# Altium schematic sheet Power.SchDoc: Laser PCB
size A3; DrawnBy: James Singleton; Organization: TMC Technology Ltd.; DocumentNumber: 8; Revision: A; SheetNumber: 8; SheetTotal: 18; Drawn Date: 22/12/2020
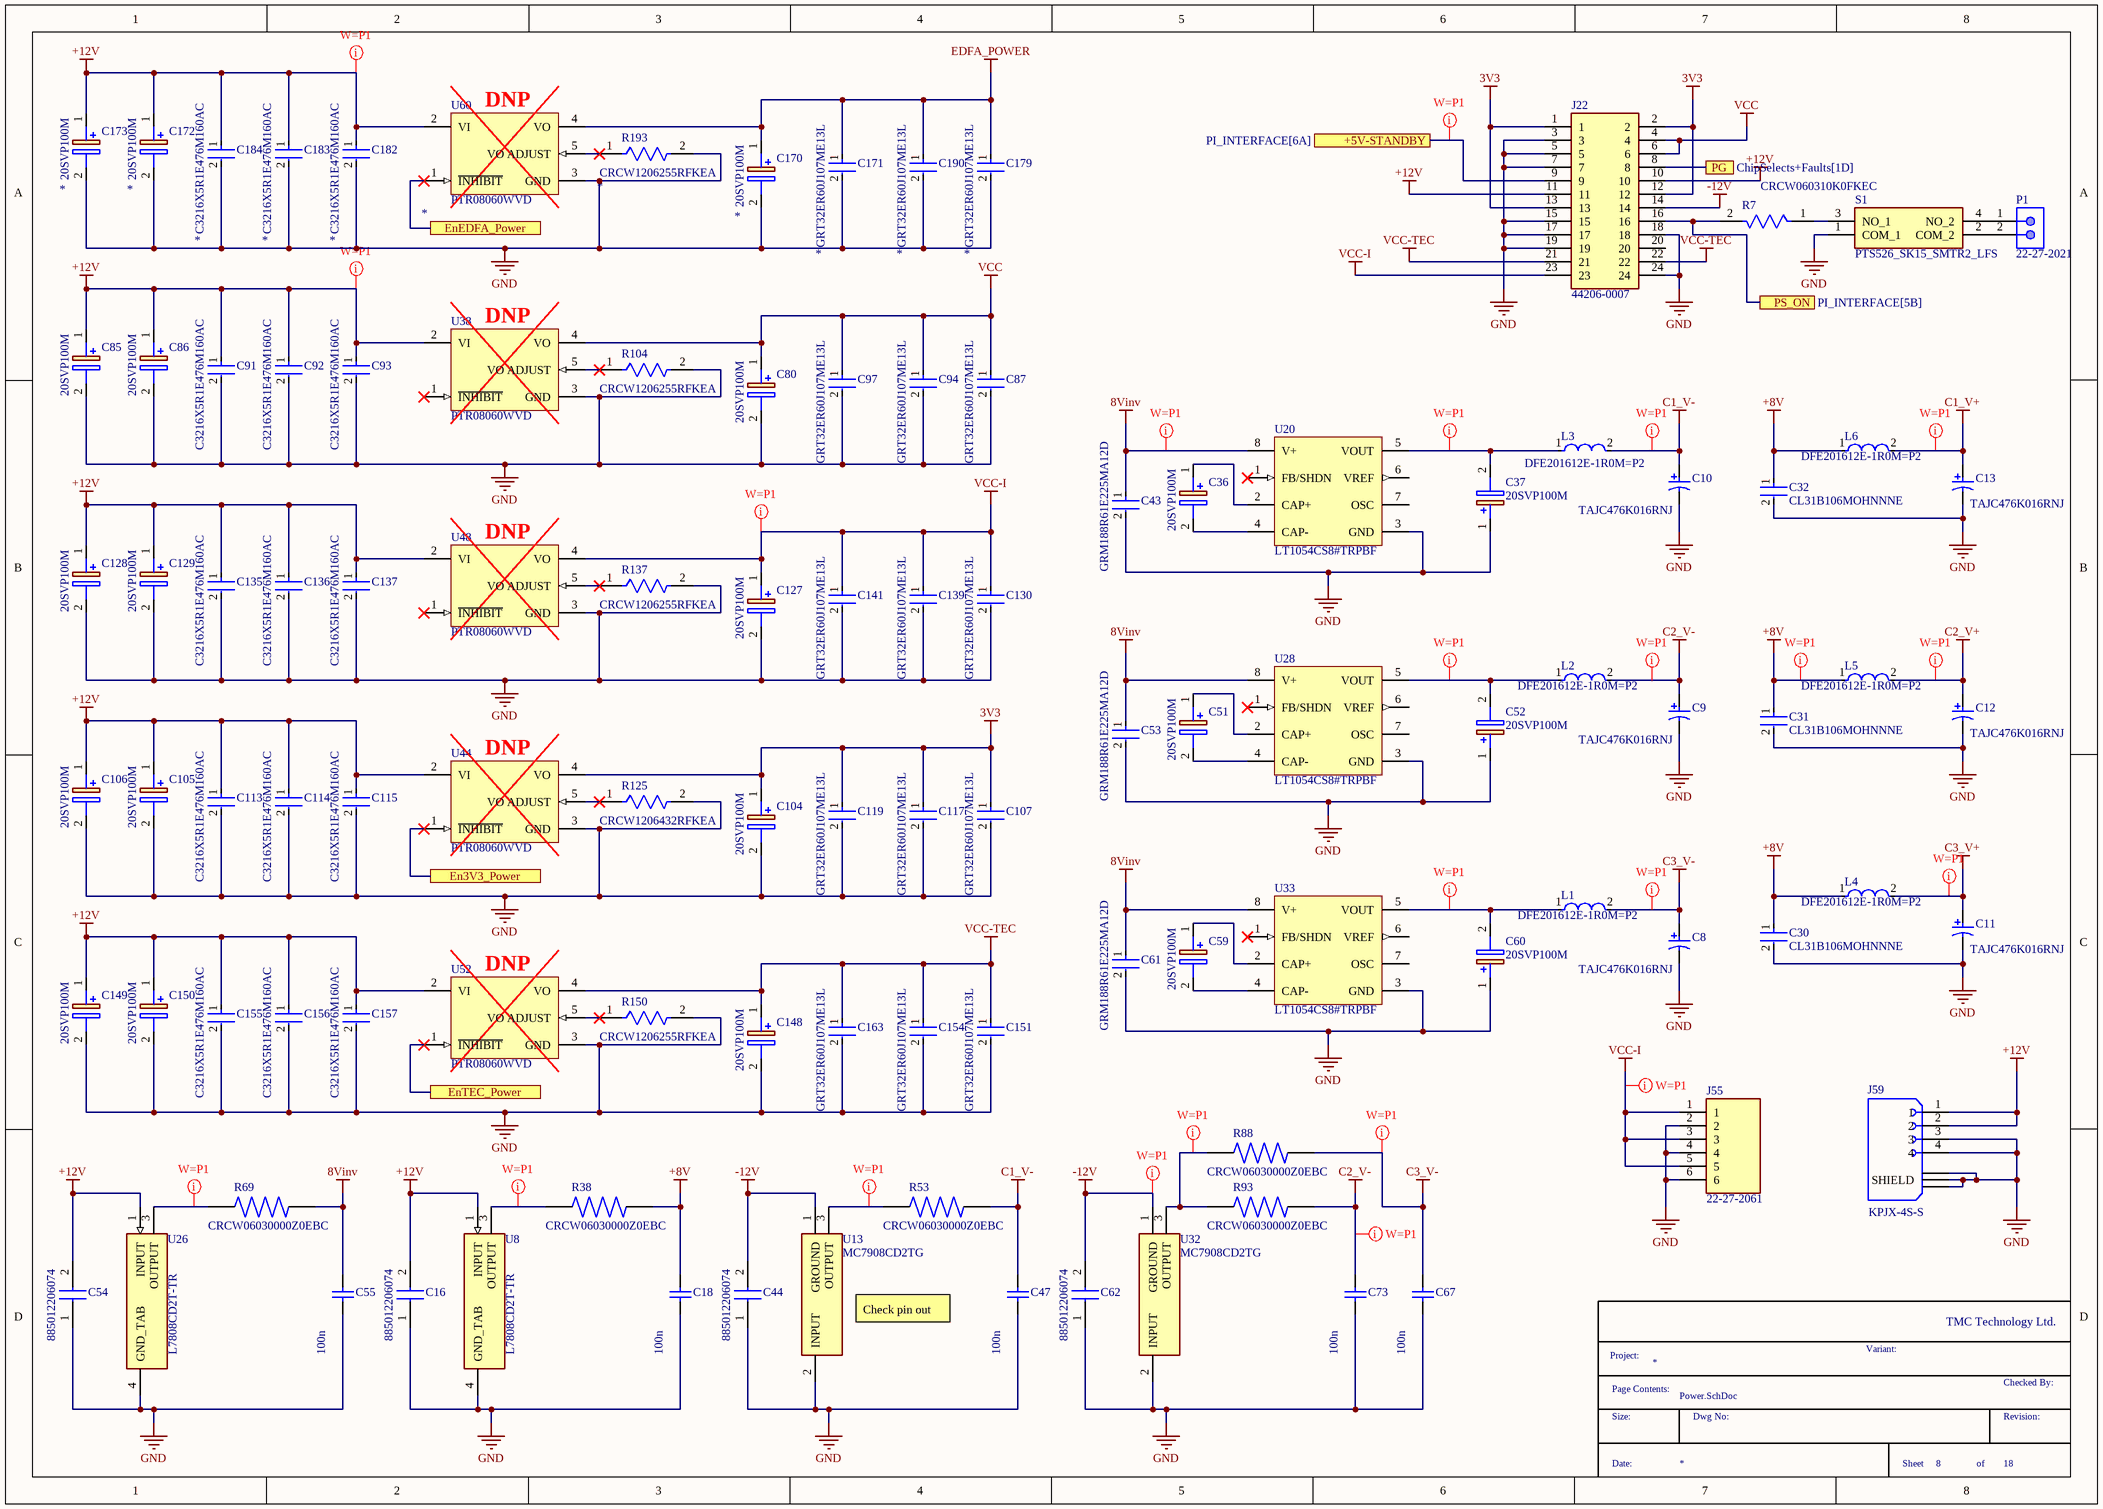
[diagram p0: Power.SchDoc]

## Parts
C8  TAJC476K016RNJ  [AVX-TAJ-C-2_M]
C9  TAJC476K016RNJ  [AVX-TAJ-C-2_M]
C10  TAJC476K016RNJ  [AVX-TAJ-C-2_M]
C11  TAJC476K016RNJ  [AVX-TAJ-C-2_M]
C12  TAJC476K016RNJ  [AVX-TAJ-C-2_M]
C13  TAJC476K016RNJ  [AVX-TAJ-C-2_M]
C16  885012206074  [CAPC1608X87N]
C18  100n  [CAPC1608X90X35LL15T15]
C30  CL31B106MOHNNNE  [FP-CL31-IPC_C]
C31  CL31B106MOHNNNE  [FP-CL31-IPC_C]
C32  CL31B106MOHNNNE  [FP-CL31-IPC_C]
C36  20SVP100M  [CAPAE830X1200N]
C37  20SVP100M  [CAPAE830X1200N]
C43  GRM188R61E225MA12D  [FP-GRM188-0_1-e0_2_0_5-IPC_A]
C44  885012206074  [CAPC1608X87N]
C47  100n  [CAPC1608X90X35LL15T15]
C51  20SVP100M  [CAPAE830X1200N]
C52  20SVP100M  [CAPAE830X1200N]
C53  GRM188R61E225MA12D  [FP-GRM188-0_1-e0_2_0_5-IPC_A]
C54  885012206074  [CAPC1608X87N]
C55  100n  [CAPC1608X90X35LL15T15]
C59  20SVP100M  [CAPAE830X1200N]
C60  20SVP100M  [CAPAE830X1200N]
C61  GRM188R61E225MA12D  [FP-GRM188-0_1-e0_2_0_5-IPC_A]
C62  885012206074  [CAPC1608X87N]
C67  100n  [CAPC1608X90X35LL15T15]
C73  100n  [CAPC1608X90X35LL15T15]
C80  20SVP100M  [CAPAE830X1200N]
C85  20SVP100M  [CAPAE830X1200N]
C86  20SVP100M  [CAPAE830X1200N]
C87  GRT32ER60J107ME13L  [FP-GRT32E-0_3-IPC_A]
C91  C3216X5R1E476M160AC  [FP-C3216-160-MFG]
C92  C3216X5R1E476M160AC  [FP-C3216-160-MFG]
C93  C3216X5R1E476M160AC  [FP-C3216-160-MFG]
C94  GRT32ER60J107ME13L  [FP-GRT32E-0_3-IPC_A]
C97  GRT32ER60J107ME13L  [FP-GRT32E-0_3-IPC_A]
C104  20SVP100M  [CAPAE830X1200N]
C105  20SVP100M  [CAPAE830X1200N]
C106  20SVP100M  [CAPAE830X1200N]
C107  GRT32ER60J107ME13L  [FP-GRT32E-0_3-IPC_A]
C113  C3216X5R1E476M160AC  [FP-C3216-160-MFG]
C114  C3216X5R1E476M160AC  [FP-C3216-160-MFG]
C115  C3216X5R1E476M160AC  [FP-C3216-160-MFG]
C117  GRT32ER60J107ME13L  [FP-GRT32E-0_3-IPC_A]
C119  GRT32ER60J107ME13L  [FP-GRT32E-0_3-IPC_A]
C127  20SVP100M  [CAPAE830X1200N]
C128  20SVP100M  [CAPAE830X1200N]
C129  20SVP100M  [CAPAE830X1200N]
C130  GRT32ER60J107ME13L  [FP-GRT32E-0_3-IPC_A]
C135  C3216X5R1E476M160AC  [FP-C3216-160-MFG]
C136  C3216X5R1E476M160AC  [FP-C3216-160-MFG]
C137  C3216X5R1E476M160AC  [FP-C3216-160-MFG]
C139  GRT32ER60J107ME13L  [FP-GRT32E-0_3-IPC_A]
C141  GRT32ER60J107ME13L  [FP-GRT32E-0_3-IPC_A]
C148  20SVP100M  [CAPAE830X1200N]
C149  20SVP100M  [CAPAE830X1200N]
C150  20SVP100M  [CAPAE830X1200N]
C151  GRT32ER60J107ME13L  [FP-GRT32E-0_3-IPC_A]
C154  GRT32ER60J107ME13L  [FP-GRT32E-0_3-IPC_A]
C155  C3216X5R1E476M160AC  [FP-C3216-160-MFG]
C156  C3216X5R1E476M160AC  [FP-C3216-160-MFG]
C157  C3216X5R1E476M160AC  [FP-C3216-160-MFG]
C163  GRT32ER60J107ME13L  [FP-GRT32E-0_3-IPC_A]
C170  20SVP100M  [CAPAE830X1200N]
C171  GRT32ER60J107ME13L  [FP-GRT32E-0_3-IPC_A]
C172  20SVP100M  [CAPAE830X1200N]
C173  20SVP100M  [CAPAE830X1200N]
C179  GRT32ER60J107ME13L  [FP-GRT32E-0_3-IPC_A]
C182  C3216X5R1E476M160AC  [FP-C3216-160-MFG]
C183  C3216X5R1E476M160AC  [FP-C3216-160-MFG]
C184  C3216X5R1E476M160AC  [FP-C3216-160-MFG]
C190  GRT32ER60J107ME13L  [FP-GRT32E-0_3-IPC_A]
J22  44206-0007  [442060007]
J55  22-27-2061  [HDRV6W64P0X254_1X6_1524X580X1170P]
J59  KPJX-4S-S  [KYCON_KPJX-4S-S]
L1  DFE201612E-1R0M=P2  [FP-DFE201612C-IPC_A]
L2  DFE201612E-1R0M=P2  [FP-DFE201612C-IPC_A]
L3  DFE201612E-1R0M=P2  [FP-DFE201612C-IPC_A]
L4  DFE201612E-1R0M=P2  [FP-DFE201612C-IPC_A]
L5  DFE201612E-1R0M=P2  [FP-DFE201612C-IPC_A]
L6  DFE201612E-1R0M=P2  [FP-DFE201612C-IPC_A]
P1  22-27-2021  [MOLX-22-27-2021_V]
R7  CRCW060310K0FKEC  [FP-CRCW0603-e3-IPC_A]
R38  CRCW06030000Z0EBC  [RESC1608X55N]
R53  CRCW06030000Z0EBC  [RESC1608X55N]
R69  CRCW06030000Z0EBC  [RESC1608X55N]
R88  CRCW06030000Z0EBC  [RESC1608X55N]
R93  CRCW06030000Z0EBC  [RESC1608X55N]
R104  CRCW1206255RFKEA  [FP-CRCW1206-e3-IPC_C]
R125  CRCW1206432RFKEA  [FP-CRCW1206-e3-IPC_B]
R137  CRCW1206255RFKEA  [FP-CRCW1206-e3-IPC_C]
R150  CRCW1206255RFKEA  [FP-CRCW1206-e3-IPC_B]
R193  CRCW1206255RFKEA  [FP-CRCW1206-e3-IPC_C]
S1  PTS526_SK15_SMTR2_LFS  [PTS526SK15SMTR2LFS]
U8  L7808CD2T-TR  [TO254P1542X460-3N]
U13  MC7908CD2TG  [MC7908CD2TR4G]
U20  LT1054CS8#TRPBF  [LT-S8-8_M]
U26  L7808CD2T-TR  [TO254P1542X460-3N]
U28  LT1054CS8#TRPBF  [LT-S8-8_M]
U32  MC7908CD2TG  [MC7908CD2TR4G]
U33  LT1054CS8#TRPBF  [LT-S8-8_M]
U38  PTR08060WVD  [EDP0005A]
U44  PTR08060WVD  [EDP0005A]
U48  PTR08060WVD  [EDP0005A]
U52  PTR08060WVD  [EDP0005A]
U60  PTR08060WVD  [EDP0005A]

## Ports
+5V-STANDBY (see PI_INTERFACE[6A]), En3V3_Power, EnEDFA_Power, EnTEC_Power, PG (see ChipSelects+Faults[1D]), PS_ON (see PI_INTERFACE[5B])

## Nets
3V3: C104.1(+) C107.1 C117.1 C119.1 J22.1 J22.2 J22.12 J22.13 U44.4(VO)
8Vinv: C43.1 C53.1 C55.2 C61.1 R69.2 U20.8(V+) U28.8(V+) U33.8(V+)
+8V: C18.2 C30.1 C31.1 C32.1 L4.1 L5.1 L6.1 R38.2
+12V: C16.2 C54.2 C85.1(+) C86.1(+) C91.1 C92.1 C93.1 C105.1(+) C106.1(+) C113.1 C114.1 C115.1 C128.1(+) C129.1(+) C135.1 C136.1 C137.1 C149.1(+) C150.1(+) C155.1 C156.1 C157.1 C172.1(+) C173.1(+) C182.1 C183.1 C184.1 J22.10 J22.11 J59.1 J59.2 U8.1(INPUT) U26.1(INPUT) U38.2(VI) U44.2(VI) U48.2(VI) U52.2(VI) U60.2(VI)
-12V: C44.2 C62.2 J22.14 U13.1(GROUND) U32.1(GROUND)
C1_V+: C13.1 L6.2
C1_V-: C10.1 C47.2 L3.2 R53.2
C2_V+: C12.1 L5.2
C2_V-: C9.1 C73.2 L2.2 R93.2
C3_V+: C11.1 L4.2
C3_V-: C8.1 C67.2 L1.2 R88.2
EDFA_POWER: C170.1(+) C171.1 C179.1 C190.1 U60.4(VO)
GND: C8.2 C9.2 C10.2 C11.2 C12.2 C13.2 C16.1 C18.1 C30.2 C31.2 C32.2 C37.1(+) C43.2 C44.1 C47.1 C52.1(+) C53.2 C54.1 C55.1 C60.1(+) C61.2 C62.1 C67.1 C73.1 C80.2(-) C85.2(-) C86.2(-) C87.2 C91.2 C92.2 C93.2 C94.2 C97.2 C104.2(-) C105.2(-) C106.2(-) C107.2 C113.2 C114.2 C115.2 C117.2 C119.2 C127.2(-) C128.2(-) C129.2(-) C130.2 C135.2 C136.2 C137.2 C139.2 C141.2 C148.2(-) C149.2(-) C150.2(-) C151.2 C154.2 C155.2 C156.2 C157.2 C163.2 C170.2(-) C171.2 C172.2(-) C173.2(-) C179.2 C182.2 C183.2 C184.2 C190.2 J22.3 J22.5 J22.7 J22.15 J22.17 J22.18 J22.19 J22.24 J55.2 J55.4 J55.6 J59.3 J59.4 J59.S1(SHIELD) J59.S2(SHIELD) J59.S3(SHIELD) R104.2 R125.2 R137.2 R150.2 R193.2 S1.1(COM_1) U8.4(GND_TAB) U13.2(INPUT) U20.3(GND) U26.4(GND_TAB) U28.3(GND) U32.2(INPUT) U33.3(GND) U38.3(GND) U44.3(GND) U48.3(GND) U52.3(GND) U60.3(GND)
VCC: C80.1(+) C87.1 C94.1 C97.1 J22.4 J22.6 U38.4(VO)
VCC-I: C127.1(+) C130.1 C139.1 C141.1 J22.23 J55.1 J55.3 J55.5 U48.4(VO)
VCC-TEC: C148.1(+) C151.1 C154.1 C163.1 J22.21 J22.22 U52.4(VO)
+5V-STANDBY: J22.9 ; port +5V-STANDBY
En3V3_Power: U44.1(~{INHIBIT}) ; port En3V3_Power
EnEDFA_Power: U60.1(~{INHIBIT}) ; port EnEDFA_Power
EnTEC_Power: U52.1(~{INHIBIT}) ; port EnTEC_Power
PG: J22.8 ; port PG
PS_ON: J22.16 R7.2 ; port PS_ON
NetC36_1: C36.1(+) U20.2(CAP+)
NetC36_2: C36.2(-) U20.4(CAP-)
NetC37_2: C37.2(-) L3.1 U20.5(VOUT)
NetC51_1: C51.1(+) U28.2(CAP+)
NetC51_2: C51.2(-) U28.4(CAP-)
NetC52_2: C52.2(-) L2.1 U28.5(VOUT)
NetC59_1: C59.1(+) U33.2(CAP+)
NetC59_2: C59.2(-) U33.4(CAP-)
NetC60_2: C60.2(-) L1.1 U33.5(VOUT)
NetP1_1: P1.1 S1.4(NO_2)
NetP1_2: P1.2 S1.2(COM_2)
NetR7_1: R7.1 S1.3(NO_1)
NetR38_1: R38.1 U8.3(OUTPUT)
NetR53_1: R53.1 U13.3(OUTPUT)
NetR69_1: R69.1 U26.3(OUTPUT)
NetR88_1: R88.1 R93.1 U32.3(OUTPUT)
NetR104_1: R104.1 U38.5(VO_ADJUST)
NetR125_1: R125.1 U44.5(VO_ADJUST)
NetR137_1: R137.1 U48.5(VO_ADJUST)
NetR150_1: R150.1 U52.5(VO_ADJUST)
NetR193_1: R193.1 U60.5(VO_ADJUST)

Not connected (* = marked no-connect by the designer): J22 20; U20 1(FB/SHDN)* 6(VREF) 7(OSC); U28 1(FB/SHDN)* 6(VREF) 7(OSC); U33 1(FB/SHDN)* 6(VREF) 7(OSC); U38 1(~{INHIBIT})*; U48 1(~{INHIBIT})*

## Layout directives
mark named W=P1: 8Vinv, +8V, +12V, -12V, C1_V+, C1_V-, C2_V+, C2_V-, C3_V+, C3_V-, NetC37_2, NetC52_2, NetC60_2, NetR38_1, NetR53_1, NetR69_1, NetR88_1, VCC-I
net class PowerOne: +5V-STANDBY

## Notes on the sheet
- (near U60) DNP
- (near U38) DNP
- (near U48) DNP
- (near U44) DNP
- (near U52) DNP
- (near U13) Check pin out
- TMC Technology Ltd.
- Page Contents:
- Project:
- Variant:
- Checked By:
- Size:
- Date:
- Dwg No:
- Sheet
- of
- Revision:

## Library data of the parts
C8-C13 = CMP-2100-03692-1: Standard Tantalum, 47 uF, +/- 10%, 16 V, -55 to 125 degC, 2-Pin SMD (2312), RoHS, Tape and Reel; Manufacturer: Kyocera AVX; Voltage Rating: 16V; Capacitance: 47uF; Leakage Current: 7.5uA; Dissipation Factor: 6%; ESR (Equivalent Series Resistance): 500mOhm; Resistance: 0.5Ohm; Polarity: Polar; RoHSCompliant: True; Datasheet URL: http://datasheets.avx.com/TAJ.pdf; Number of Pins: 2; Height - Seated (Max): 0.11inch; Package Description: 2-Pin Surface Mount Device, Body 6 x 3.25 mm; REACH SVHC: NoSVHC; Width: 3.2mm; Case/Package: Molded; Radiation Hardening: No; Max Operating Temperature: 125degC; Package Reference: TAJ-C-2; Package Quantity: 1; Manufacturer URL: http://www.avx.com/; Packaging: TapeandReel; Height: 2.6mm; Dielectric Material: Tantalum; Voltage Rating (DC): 16V; Datasheet Version: 42401.0; Voltage: 16V; Length: 6mm; Depth: 3.2mm; Termination: SMD/SMT; Tolerance: 10%; Case Code (Imperial): 2312; Min Operating Temperature: -55degC; Case Code (Metric): 6032; Lead Free: LeadFree; C1_V+: *; Manufacturer Part Number: TAJC476K016RNJ
C16 C44 C54 C62 = 885012206074: Capacitor; Manufacturer_Name: Wurth Elektronik; Datasheet Link: https://katalog.we-online.com/pbs/datasheet/885012206074.pdf; Height: 0.87mm; Manufacturer_Part_Number: 885012206074; 8Vinv: *
C18 C47 C55 C67 C73 = CMP-1035-02592-3: Chip Capacitor, 100 nF, +/- 10%, 50 V, -55 to 125 degC, 0603 (1608 Metric), RoHS, Tape and Reel; Manufacturer: KEMET; Manufacturer Part Number: C0603C104K5RACTU; Case\Package: 0603; Type (Capacitors): X7R; Capacitance: 100 nF; Voltage Rating: 50 V; Pins: 2; Max Operating Temperature: 125 degC; Min Operating Temperature: -55 degC; Case Code (Imperial): 0603; DatasheetVersion: 07/2016; Package Quantity: 4000; Length: 1.6 mm; REACH SVHC: No SVHC; Packaging: Tape and Reel; Case Code (Metric): 1608; Mounting Technology: Surface Mount; RoHSCompliant: true; Height: 0.9 mm; ComponentLink1URL: http://www.avx.com/; ComponentLink2URL: http://datasheets.avx.com/X7RDielectric.pdf; Mount: Surface Mount; ComponentLink2Description: Datasheet; Width: 0.81 mm; PackageReference: 0603; PackageDescription: 2-Pin Surface Mount Device, Body 1.6 x 0.81 mm; Radiation Hardening: No; ComponentLink1Description: Manufacturer URL; Voltage Rating (DC): 50 V; Tolerance: 10%; 8Vinv: *
C30-C32 = CMP-13271-001633-1: Cap Ceramic 10uF 16V X7R ±20% SMD 1206 +125°C Embossed T/R; Manufacturer: Samsung; Width: 0.063inch; Dielectric: X7R; Length: 0.126inch; Thickness: 0.071inch; Mount: Surface Mount; Packaging: Tape and Reel; Case Code (Imperial): 1206; Min Operating Temperature: -55°C; Tolerance: 20%; Case Code (Metric): 3216; Max Operating Temperature: 125°C; Voltage Rating: 16V; Capacitance: 10uF; Case/Package: 1206; Voltage Rating (DC): 16V; C1_V+: *; Manufacturer Part Number: CL31B106MOHNNNE
C36 C37 C51 C52 C59 C60 C80 C85 C86 C104-C106 C127-C129 C148-C150 C170 C172 C173 = 20SVP100M: Capacitor Polarised; Manufacturer_Name: Panasonic; Datasheet Link: https://industrial.panasonic.com/cdbs/www-data/pdf/AAB8000/AAB8000C193.pdf; Height: 12mm; Manufacturer_Part_Number: 20SVP100M; VCC-A_PSU: *
  C80 C85 C86: ClassName: VCC_PSU
  C104-C106: ClassName: 3V3_PSU
  C127-C129: ClassName: VCC_I_PSU
  C148-C150: ClassName: VCC_TEC_PSU
  C170 C172 C173: ClassName: EDFA_POWER
C43 C53 C61 = CMP-06035-050530-1: Chip Multilayer Ceramic Capacitors for General Purpose, 0603, 2.2uF, X5R, 15%, 20%, 25V; Manufacturer: Murata; Case Code (Metric): 1608; Height: 0.8mm; Termination: SMD/SMT; Packaging: Tape and Reel; Case Code (Imperial): 0603; Voltage Rating (DC): 25V; Dielectric: X5R; Case/Package: 0603; Thickness: 0.035inch; Tolerance: 20%; Weight: 0.000222oz; Voltage Rating: 25V; Resistor Type: Ceramic; Mount: Surface Mount; Package Quantity: 4000; Length: 0.063inch; Max Operating Temperature: 85°C; Min Operating Temperature: -55°C; Capacitance: 2.2uF; Width: 0.031inch; C1_V-: *; Manufacturer Part Number: GRM188R61E225MA12D
C87 C94 C97 C107 C117 C119 C130 C139 C141 C151 C154 C163 C171 C179 C190 = CMP-06035-004067-1: Multi-Layer Ceramic Capacitor 100uF 6.3V X5R ±20% 1210 Emboss T/R; Manufacturer: Murata; Mount: Surface Mount; Capacitance: 100uF; Case Code (Imperial): 1210; Thickness: 0.106inch; Packaging: Tape and Reel; Case/Package: 1210; Case Code (Metric): 3225; Tolerance: 20%; Max Operating Temperature: 85°C; Width: 0.098inch; Ratings: AEC-Q200; Min Operating Temperature: -55°C; Length: 0.126inch; Voltage Rating: 6.3V; VCC-A_PSU: *; Manufacturer Part Number: GRT32ER60J107ME13L
  C87 C94 C97: ClassName: VCC_PSU
  C107 C117 C119: ClassName: 3V3_PSU
  C130 C139 C141: ClassName: VCC_I_PSU
  C151 C154 C163: ClassName: VCC_TEC_PSU
  C171 C179 C190: ClassName: EDFA_POWER
C91-C93 C113-C115 C135-C137 C155-C157 C182-C184 = CMP-2000-05397-2: CAP CER 47UF 25V X5R 1206; 3DS Part Number: 220-00004; Manufacturer: TDK; Temperature Coefficient: 15%; Tolerance: 20%; Material: Ceramic; Height: 1.8mm; Device Class L1: Passive Components; Temperature Characteristic: X5R; Voltage: 25V; Digikey Description: CAP CER 47UF 25V X5R 1206; Voltage Rating: 25V; ComponentLink2URL: https://product.tdk.com/info/en/catalog/datasheets/mlcc_commercial_general_en.pdf; Category: Cap; Capacitance: 47uF; Ipc Land Pattern Name: CAPC320160X160; Temperature Range High: +85°C; ComponentLink2Description: Datasheet; Temperature: -55°C to +85°C; Mouser Description: Multilayer Ceramic Capacitors MLCC - SMD/SMT 1206 47uF 25volts X5R 20%; Lead Free: Yes; RoHS: TRUE; Device Class L2: Capacitors; Device Class L3: Ceramic Capacitors; Manufacturer Part Number: C3216X5R1E476M160AC; Automotive: No; Temperature Range Low: -55°C; Footprint Url: https://product.tdk.com/info/en/catalog/spec/mlccspec_commercial_general_midvoltage_en.pdf; Value: 47uF; Octopart: https://octopart.com/c3216x5r1e476m160ac-tdk-25947783; Package: C3216-160; VCC-A_PSU: *
  C91-C93: ClassName: VCC_PSU
  C113-C115: ClassName: 3V3_PSU
  C135-C137: ClassName: VCC_I_PSU
  C155-C157: ClassName: VCC_TEC_PSU
  C182-C184: ClassName: EDFA_POWER
J22 = 44206-0007: Connector; Manufacturer_Name: Molex; Datasheet Link: https://www.molex.com/pdm_docs/sd/442060007_sd.pdf; Height: 12.8mm; Manufacturer_Part_Number: 44206-0007; POWER_INLET: *; System: Connector
J55 = 22-27-2061: Connector; Manufacturer_Name: Molex; Datasheet Link: https://componentsearchengine.com//22-27-2061.pdf; Height: 11.7mm; Mouser2 Part Number: 538-22-27-2061; Mouser2 Price/Stock: https://www.mouser.com/Search/Refine.aspx?Keyword=538-22-27-2061; Manufacturer_Part_Number: 22-27-2061
J59 = KPJX-4S-S: 4 (Power) Position Circular Connector Jack, Female Sockets Solder; MF: Kycon; Value: *; Price: None; Package: SOIC-20 Kycon; Availability: Warning; Purchase-URL: https://pricing.snapeda.com/search/part/KPJX-4S-S/?ref=eda; MP: KPJX-4S-S; SnapEDA_Link: https://www.snapeda.com/parts/KPJX-4S-S/Kycon/view-part/584570/?ref=snap; Check_prices: https://www.snapeda.com/parts/KPJX-4S-S/Kycon/view-part/584570/?ref=eda
L1-L6 = CMP-06042-011635-1: Shielded Wirewound Inductor 1uH 20% 2900mA 0.048Ω 0806 (2016); Manufacturer: Murata; C1_V+: *; Manufacturer Part Number: DFE201612E-1R0M=P2
P1 = CMP-2000-05537-1: Male Header, Pitch 2.54 mm, 1 x 2 Position, Height 11.7 mm, Tail Length 3.56 mm, 0 to 75 degC, RoHS, Bulk; Manufacturer: Molex; PartNumber: 0022272021; Current rating: 4A; Package Version: Rev. BC, 02/2012; Voltage rating: 250V; No. of Positions: 2; Pitch: 2.54mm; No. of Rows: 1; System: Connector; Orientation: Vertical; Operating temperature: 0°Cto+75°C; Manufacturer URL: http://www.molex.com/; Mounting Technology: ThroughHole; Housing material: Nylon(UL94V-0); Package Description: 2-Leads Header, Body 5.08 x 5.8 mm, Pitch 2.54 mm; Voltage - Max: 250V; Datasheet URL: http://www.molex.com/pdm_docs/sd/022272021_sd.pdf; Package Reference: 22-27-2021; Contact material: Tinplatedbrass; Current - Max: 4A; Datasheet Version: Rev. F, 06/2009; POWER_INLET: *; Manufacturer Part Number: 22-27-2021
R7 = CMP-02407-006151-1: RES Thick Film, 10kΩ, 1%, 0.1W, 100ppm/°C, 0603; Manufacturer: Vishay Dale; Max Power Dissipation: 100mW; Resistance: 10kR; Radiation Hardening: No; Height: 0.02inch; Case Code (Metric): 1608; Case/Package: 0603; Case Code (Imperial): 0603; Lead Free: Lead Free; Tolerance: 1%; Number of Terminations: 2; Width: 0.033inch; Temperature Coefficient: 100ppm/°C; Length: 0.061inch; Max Operating Temperature: 155°C; Contact Plating: Tin; Depth: 0.85mm; Packaging: Tape and Reel; Composition: Thick Film; Power Rating: 100mW; Military Standard: Not; Min Operating Temperature: -55°C; Features: Automotive AEC-Q200; POWER_INLET: *; Manufacturer Part Number: CRCW060310K0FKEC
R38 R53 R69 R88 R93 = CRCW06030000Z0EBC: 0 Ohms Jumper 0.1W, 1/10W Chip Resistor 0603 (1608 Metric) Thick Film; MF: Vishay Dale; MP: CRCW06030000Z0EBC; Purchase-URL: https://pricing.snapeda.com/search/part/CRCW06030000Z0EBC/?ref=eda; SnapEDA_Link: https://www.snapeda.com/parts/CRCW06030000Z0EBC/Vishay%20Dale/view-part/3605563/?ref=snap; Availability: Warning; Package: 1608 Rohm Semiconductor; Value: *; Price: None; Check_prices: https://www.snapeda.com/parts/CRCW06030000Z0EBC/Vishay%20Dale/view-part/3605563/?ref=eda; 8Vinv: *
R104 R137 R193 = CMP-2003-01995-2: RES Thick Film, 255Ω, 1%, 0.25W, 100ppm/°C, 1206; Manufacturer: Vishay; Voltage Rating: 200V; Power Rating: 250mW; Resistance: 255R; Mount: Surface Mount; Temperature Coefficient: 100ppm/°C; Weight: 0.000353oz; Tolerance: 1%; Composition: Thick Film; Radiation Hardening: No; Depth: 1.6mm; Lead Free: Lead Free; Min Operating Temperature: -55°C; Length: 3.2mm; Case/Package: 1206; Case Code (Metric): 3216; Packaging: Tape and Reel; Max Operating Temperature: 155°C; Military Standard: Not; Package Quantity: 5000; Contact Plating: Tin; Voltage Rating (DC): 200V; Termination: SMD/SMT; Height: 0.55mm; Width: 1.6mm; Case Code (Imperial): 1206; VCC-A_PSU: *; Manufacturer Part Number: CRCW1206255RFKEA
  R104: ClassName: VCC_PSU
  R137: ClassName: VCC_I_PSU
  R193: ClassName: EDFA_POWER
R125 = CMP-2003-02194-2: RES Thick Film, 432Ω, 1%, 0.25W, 100ppm/°C, 1206; Manufacturer: Vishay; Voltage Rating: 200V; Resistance: 432R; Max Power Dissipation: 250mW; Features: Automotive AEC-Q200; Termination: SMD/SMT; Weight: 0.000353oz; Lead Free: Lead Free; Packaging: Tape and Reel; Height: 0.55mm; Min Operating Temperature: -55°C; Case/Package: 1206; Power Rating: 250mW; Case Code (Metric): 3216; Military Standard: Not; Package Quantity: 10; Depth: 1.6mm; Composition: Thick Film; Temperature Coefficient: 100ppm/°C; Contact Plating: Tin; Length: 3.2mm; Radiation Hardening: No; Number of Terminations: 2; Case Code (Imperial): 1206; Voltage Rating (DC): 200V; Tolerance: 1%; Max Operating Temperature: 155°C; Width: 1.6mm; 3V3_PSU: *; Manufacturer Part Number: CRCW1206432RFKEA; ClassName: 3V3_PSU
R150 = CMP-2003-02194-2: RES Thick Film, 432Ω, 1%, 0.25W, 100ppm/°C, 1206; Manufacturer: Vishay; Voltage Rating: 200V; Resistance: 255R; Max Power Dissipation: 250mW; Features: Automotive AEC-Q200; Termination: SMD/SMT; Weight: 0.000353oz; Lead Free: Lead Free; Packaging: Tape and Reel; Height: 0.55mm; Min Operating Temperature: -55°C; Case/Package: 1206; Power Rating: 250mW; Case Code (Metric): 3216; Military Standard: Not; Package Quantity: 10; Depth: 1.6mm; Composition: Thick Film; Temperature Coefficient: 100ppm/°C; Contact Plating: Tin; Length: 3.2mm; Radiation Hardening: No; Number of Terminations: 2; Case Code (Imperial): 1206; Voltage Rating (DC): 200V; Tolerance: 1%; Max Operating Temperature: 155°C; Width: 1.6mm; 3V3_PSU: *; Manufacturer Part Number: CRCW1206255RFKEA; ClassName: VCC_TEC_PSU
S1 = PTS526_SK15_SMTR2_LFS: Switch; Manufacturer_Name: C & K COMPONENTS; Manufacturer_Part_Number: PTS526 SK15 SMTR2 LFS; Datasheet Link: https://www.ckswitches.com/media/2780/pts526.pdf; Height: 1.65mm; POWER_INLET: *
U8 U26 = L7808CD2T-TR: Integrated Circuit; Manufacturer_Name: STMicroelectronics; Datasheet Link: http://www.st.com/web/en/resource/technical/document/datasheet/CD00000444.pdf; Height: 4.6mm; Manufacturer_Part_Number: L7808CD2T-TR; 8Vinv: *
U13 U32 = MC7908CD2TG: Integrated Circuit; Manufacturer_Name: ON Semiconductor; Datasheet Link: https://www.onsemi.com/pdf/datasheet/mc7900-d.pdf; Manufacturer_Part_Number: MC7908CD2TG; C1_V-_PSU: *
U20 U28 U33 = CMP-0475-00386-1: Switched-Capacitor Voltage Converter with Regulator, 3.5 to 15 V Vin, Adjustable Vout, 8-pin SOIC (S8-8), 0 to 100 degC, Pb-Free, Tape and Reel; Manufacturer: Analog Devices / Linear Technology; Isupply(mA): 2.5; Ishutdown(uA): 100; Vin Min(V): 3.5; Frequency(kHz): 25; Vin Max(V): 15; Voutput: Adj; PackageDescription: 8-Pin Plastic Small Outline (Narrow .150 Inch), Body 4.9 x 3.9 mm, Pitch 1.27 mm; RoHS: TRUE; Packing: Tape and Reel; ComponentLink1Description: Manufacturer URL; ComponentLink2Description: Datasheet; Max Iout(mA): 100; ComponentLink2URL: http://cds.linear.com/docs/en/datasheet/1054lfg.pdf; DatasheetVersion: Rev. G; PartNumber: LT1054CS8#TRPBF; PackageReference: S8-8; ComponentLink3URL: http://cds.linear.com/docs/en/packaging/05081610_G_SO8.pdf; Mounting Technology: Surface Mount; PackageVersion: Rev. G, 03/2012; ComponentLink3Description: Package Specification; ComponentLink1URL: http://www.linear.com/; C1_V-: *; Manufacturer Part Number: LT1054CS8#TRPBF
U38 U44 U48 U52 U60 = CMP-0387-00282-2: 6 A, 4.5 to 14 V Input, Non-Isolated, Wide Output, Adjustable Power Module, -40 to 85 degC, 5-pin Module (EDP5), Pb-Free (RoHS); Manufacturer: Texas Instruments; Iout(Max)(A): 6; Vout(Min)(V): 0.6; SubFamily: Step-Down (Buck) Module; Regulated Outputs(#): 1; Vout(Max)(V): 5.5; VO Adjustable: TRUE; Vin(Max)(V): 14; Vin(Min)(V): 4.5; ComponentLink3URL: http://www.ti.com/lit/ml/mpds304/mpds304.pdf; ComponentLink1URL: http://www.ti.com/; Mounting Technology: Through Hole; Eco-Plan: Pb-Free (RoHS); PackageReference: EDP0005A; DatasheetVersion: SLTS289F; ComponentLink4URL: Samples URL:http://www.ti.com/product/ptr08060w; ComponentLink3Description: Package Specification; ComponentLink4Description: URL Link1; PartNumber: PTR08060WVD; PackageVersion: 4208201/A; ComponentLink2Description: Datasheet; ComponentLink1Description: Manufacturer URL; PackageDescription: 5-Pin Plastic Special Shape, Body 16.51 x 10.41 mm; ComponentLink2URL: http://www.ti.com/general/docs/lit/getliterature.tsp?genericPartNumber=PTR08060W&fileType=pdf; VCC-A_PSU: *; Manufacturer Part Number: PTR08060WVD
  U38: ClassName: VCC_PSU
  U44: ClassName: 3V3_PSU
  U48: ClassName: VCC_I_PSU
  U52: ClassName: VCC_TEC_PSU
  U60: ClassName: EDFA_POWER